# EAGLE design XBee-Regulated-v17 (EAGLE 5.11)
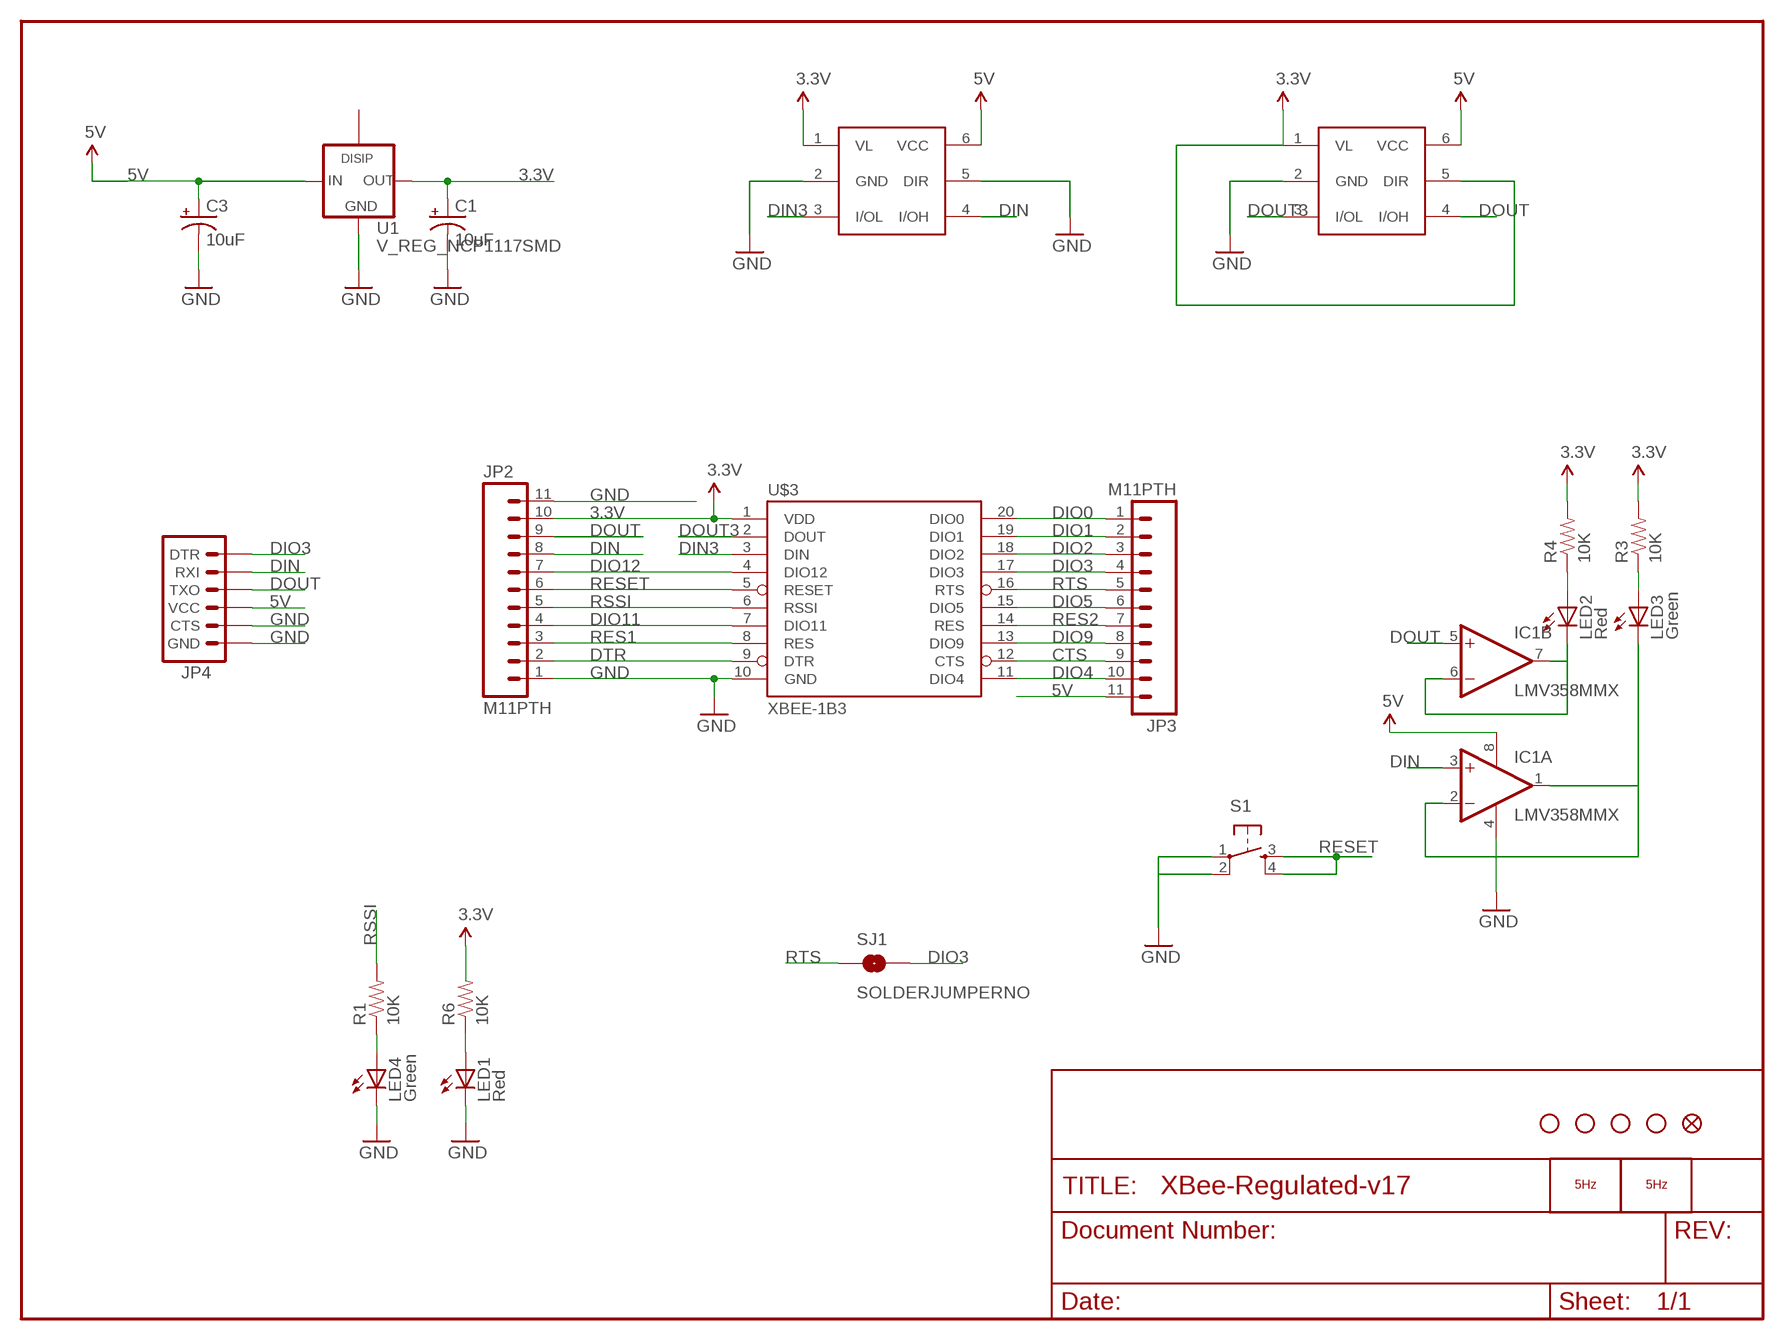
[diagram p0: schematic, sheet 1]

## Parts
C1  10uF  CAP_POL1206  [EIA3216]
C3  10uF  CAP_POL1206  [EIA3216]
IC1  LMV358MMX  [MSOP08]
JP2  M11PTH  [1X11]
JP3  M11PTH  [1X11]
JP4  ARDUINO_SERIAL_PROGRAMPTH  [1X06]
LED1  Red  LED0603  [LED-0603]
LED2  Red  LED0603  [LED-0603]
LED3  Green  LED0603  [LED-0603]
LED4  Green  LED0603  [LED-0603]
LOGO2  LOGO_5HZ_H_COOPER_10MM  [5HZ_LOGO_H_COOPER_10MM]
LOGO3  LOGO_5HZ_MAIN_5MM  [5HZ_LOGO_MAIN_5MM]
R1  10K  RESISTOR0603-RES  [0603-RES]
R3  10K  RESISTOR0603-RES  [0603-RES]
R4  10K  RESISTOR0603-RES  [0603-RES]
R6  10K  RESISTOR0603-RES  [0603-RES]
S1  TAC_SWITCHSMD  [TACTILE_SWITCH_SMD]
SJ1  SOLDERJUMPERNO  [SJ_2S-NO]
U1  V_REG_NCP1117SMD  [SOT223]
U$3  XBEE-1B3  [XBEE-SMD]
U$5  STAND-OFF  [STAND-OFF]
U$7  MAX337  [SOT-363]
U$9  STAND-OFF  [STAND-OFF]
U$10  STAND-OFF  [STAND-OFF]
U$11  STAND-OFF  [STAND-OFF]
U$12  MAX337  [SOT-363]
U$16  FIDUCIAL1X2  [FIDUCIAL-1X2]

## Nets
3.3V [vcc]: C1.A(+) JP2.10 R3.2 R4.2 R6.2 U1.2(OUT) U$3.1(VDD) U$7.1(VL) U$12.1(VL) U$12.5(DIR)
5V [vcc]: C3.A(+) IC1.8(P:V+) JP3.11 JP4.4(VCC) U1.3(IN) U$7.6(VCC) U$12.6(VCC)
CTS: JP3.9 U$3.12(CTS)
DIN: IC1.3(A:+IN) JP2.8 JP4.2(RXI) U$7.4(I/OH)
DIN3: U$3.3(DIN) U$7.3(I/OL)
DIO0: JP3.1 U$3.20(DIO0)
DIO1: JP3.2 U$3.19(DIO1)
DIO2: JP3.3 U$3.18(DIO2)
DIO3: JP3.4 JP4.1(DTR) SJ1.2 U$3.17(DIO3)
DIO4: JP3.10 U$3.11(DIO4)
DIO5: JP3.6 U$3.15(DIO5)
DIO9: JP3.8 U$3.13(DIO9)
DIO11: JP2.4 U$3.7(DIO11)
DIO12: JP2.7 U$3.4(DIO12)
DOUT: IC1.5(B:+IN) JP2.9 JP4.3(TXO) U$12.4(I/OH)
DOUT3: U$3.2(DOUT) U$12.3(I/OL)
DTR: JP2.2 U$3.9(DTR)
GND [vcc]: C1.C(-) C3.C(-) IC1.4(P:V-) JP2.1 JP2.11 JP4.5(CTS) JP4.6(GND) LED1.C LED4.C S1.1 S1.2 U1.1(GND) U$3.10(GND) U$7.2(GND) U$7.5(DIR) U$12.2(GND)
N$1: LED2.A R4.1
N$2: LED4.A R1.1
N$4: LED3.A R3.1
N$6: IC1.6(B:-IN) IC1.7(B:OUT) LED2.C
N$7: IC1.1(A:OUT) IC1.2(A:-IN) LED3.C
N$38: LED1.A R6.1
RES1: JP2.3 U$3.8(RES)
RES2: JP3.7 U$3.14(RES)
RESET: JP2.6 S1.3 S1.4 U$3.5(RESET)
RSSI: JP2.5 R1.2 U$3.6(RSSI)
RTS: JP3.5 SJ1.1 U$3.16(RTS)
Unconnected: U1.4

## Library data of the parts
C1 C3 = SparkFun:CAP_POL: Capacitor Polarized These are standard SMD and PTH capacitors. Normally 10uF, 47uF, and 100uF in electrolytic and tantalum varieties. Always verify the external diameter of the through hole cap, it varies with capacity, voltage, and manufacturer. The EIA devices should be standard.
IC1 = linear:LMV358?*: Dual General Purpose, Low Voltage, Rail-to-Rail Output Operational Amplifiers Source: http://www.national.com/mpf/LM/LMV321.html http://www.national.com/dt/lmv_qual.pdf
JP2 JP3 = SparkFun:M11: Header 11 Standard 11-pin 0.1" header. Use with straight break away headers (SKU : PRT-00116), right angle break away headers (PRT-00553), swiss pins (PRT-00743), machine pins (PRT-00117), and female headers (PRT-00115).
JP4 = SparkFun:ARDUINO_SERIAL_PROGRAM
LED1-LED4 = SparkFun:LED: LEDs Standard schematic elements and footprints for 5mm, 3mm, 1206, and 0603 sized LEDs. 5mm - Spark Fun Electronics SKU : COM-00529 (and others)
LOGO2 LOGO3 = 5hz-electronica:LOGO_5HZ: Logotipo 5Hz "según Pedro"
R1 R3 R4 R6 = SparkFun:RESISTOR: Resistor Basic schematic elements and footprints for 0603, 1206, and PTH resistors.
S1 = SparkFun:TAC_SWITCH: Momentary Switch Button commonly used for reset or general input. Spark Fun Electronics SKU : COM-00097
SJ1 = SparkFun:SOLDERJUMPER: Solder Jumper Standard SMD solder jumper. Used to automate production. Two varients : Normally Open and Normally Closed are the same, but have different paste layers. NC will have a large amount of paste and should jumper during reflow.
U1 = 5hz-electronica:V_REG_NCP1117: Voltage Regulator The NCP1117 series are low dropout positive voltage regulators that are capable of providing an output current that is in excess of 1.0 A with a maximum dropout voltage of 1.2 V at 800 mA over temperature. This series contains eight fixed output voltages of 1.5 V, 1.8 V, 2.0 V, 2.5 V, 2.85 V, 3.3 V, 5.0 V, and 12 V that have no minimum load requirement to maintain regulation. Also included is an adjustable output version that can be programmed from 1.25 V to 18.8 V with two external resistors. On chip trimming adjusts the reference/output voltage to within ±1.0% accuracy. Internal protection features consist of output current limiting, safe operating area compensation, and thermal shutdown. The NCP1117 series can operate with up to 20 V input. Devices are available in SOT-223 and DPAK packages.
U$3 = 5hz-electronica:XBEE-1
U$5 U$9-U$11 = SparkFun:STAND-OFF: Stand Off This is the mechanical footprint for a #4 phillips button head screw. Use the keepout ring to avoid running the screw head into surrounding components. SKU : PRT-00447
U$7 U$12 = MAX337:MAX337
U$16 = SparkFun:FIDUCIAL: Fiducial Alignment Points Various fiducial points for machine vision alignment.

## Net classes
1 vcc: width 0.254 mm
2 gnd: width 0.254 mm

## Board
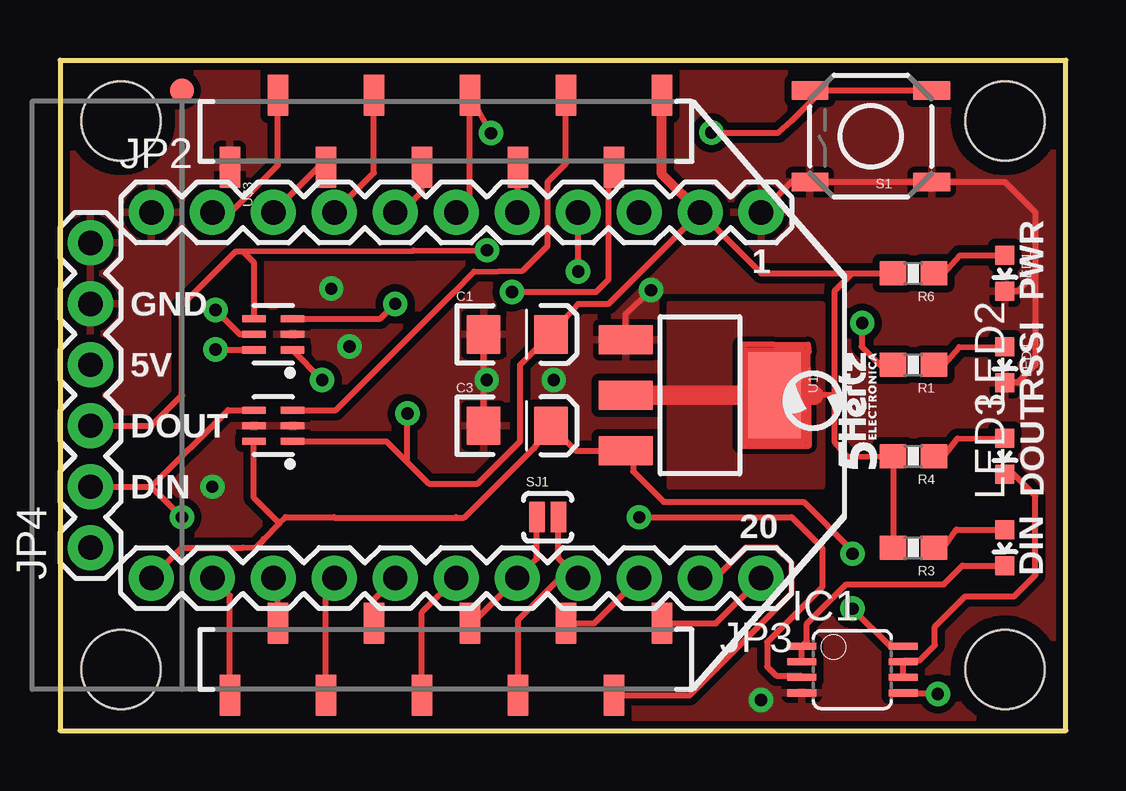
[diagram p1: board, top side]
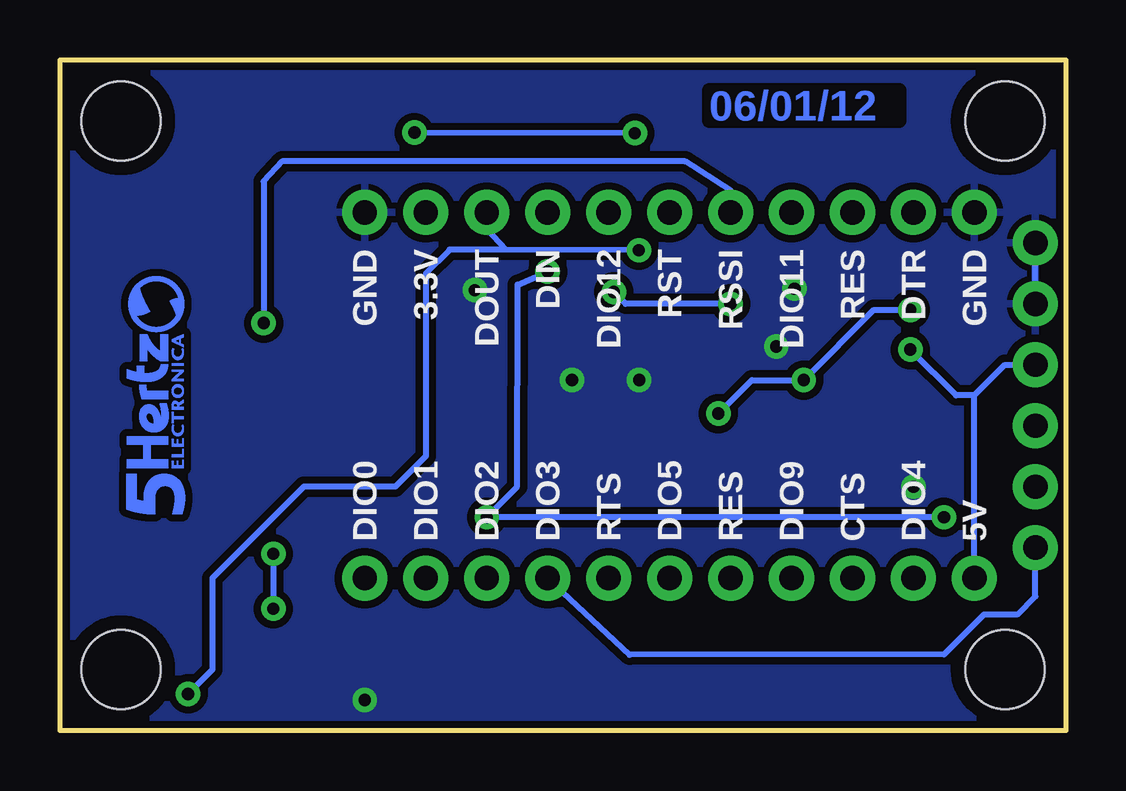
[diagram p2: board, bottom side, seen from below]

Size 41.91 x 27.94 mm. Coordinates in mm from the lower left corner, seen from the top.
Outline: 41.91,0 41.91,27.94 0,27.94 0,0 41.91,0
Copper layers (1*16): Top 0.035mm / dielectric 1.5mm / Bottom 0.035mm
Design rules: minimum track width 8mil, minimum drill 20mil, track to track 8mil, track to pad 8mil, pad to pad 8mil, via to via 8mil, smd to smd 8mil, copper to edge 10mil, drill to drill 8mil, minimum pad ring 12mil, minimum via ring 10mil, stop-mask expansion 4mil, vias tented up to drill 25mil, thermal gap 10mil

### Footprints (pad centres in the part's own frame; a part is rotated, then mirrored left to right if it is on the bottom)
EIA3216 = smd 1.4 x 1.6: A 1.4,0; C -1.4,0
MSOP08 = smd 0.3 x 1.2: 1 -0.976,-2.113; 2 -0.326,-2.113; 3 0.324,-2.113; 4 0.974,-2.113; 5 0.974,2.112; 6 0.324,2.112; 7 -0.326,2.112; 8 -0.976,2.112
1X11 = drill 1.016 pad 1.88: 1 0,0; 2 2.54,0; 3 5.08,0; 4 7.62,0; 5 10.16,0; 6 12.7,0; 7 15.24,0; 8 17.78,0; 9 20.32,0; 10 22.86,0; 11 25.4,0
1X06 = drill 1.016 pad 1.88: 1 0,0; 2 2.54,0; 3 5.08,0; 4 7.62,0; 5 10.16,0; 6 12.7,0
LED-0603 = smd 0.8 x 0.8: A 0,-0.75; C 0,0.75
0603-RES = smd 1.1 x 1: 1 -0.85,0; 2 0.85,0
TACTILE_SWITCH_SMD = smd 1.524 x 0.762: 1 -2.54,1.905; 2 2.54,1.905; 3 -2.54,-1.905; 4 2.54,-1.905
SJ_2S-NO = smd 0.635 x 1.27: 1 -0.45,0; 2 0.45,0
SOT223 = smd 1.219 x 2.235: 1 -2.311,-3.099; 2 0,-3.099; 3 2.311,-3.099 | smd 3.6 x 2.2: 4 0,3.099
XBEE-SMD = smd 1.7 x 0.85: 1 -12.5,20; 2 -9.5,18; 3 -12.5,16; 4 -9.5,14; 5 -12.5,12; 6 -9.5,10; 7 -12.5,8; 8 -9.5,6; 9 -12.5,4; 10 -9.5,2; 11 12.5,2; 12 9.5,4; 13 12.5,6; 14 9.5,8; 15 12.5,10; 16 9.5,12; 17 12.5,14; 18 9.5,16; 19 12.5,18; 20 9.5,20
STAND-OFF = hole 3.302: 0,0
SOT-363 = smd 0.3 x 0.99: 1 -0.65,-0.8; 2 0,-0.8; 3 0.65,-0.8; 4 0.65,0.81; 5 0,0.81; 6 -0.65,0.81
FIDUCIAL-1X2 = smd 1 x 1: 1 0,0

### Placement (x,y rotation side)
C1  19.05,16.51 0 top
C3  19.05,12.7 0 top
IC1  33.02,2.54 270 top
JP2  3.81,21.59 0 top
JP3  29.21,6.35 180 top
JP4  1.27,7.62 90 top
LED1  39.37,19.05 180 top
LED2  39.37,11.43 180 top
LED3  39.37,7.62 180 top
LED4  39.37,15.24 180 top
LOGO2  36.7,9.02 90 bottom
LOGO3  34.04,10.92 90 top
R1  35.56,15.24 180 top
R3  35.56,7.62 180 top
R4  35.56,11.43 180 top
R6  35.56,19.05 180 top
S1  33.78,24.77 180 top
SJ1  20.32,8.89 0 top
U1  26.67,13.97 270 top
U$3  5.08,13.97 270 top
U$5  2.54,2.54 0 top
U$7  8.89,12.7 90 top
U$9  2.54,25.4 0 top
U$10  39.37,25.4 0 top
U$11  39.37,2.54 0 top
U$12  8.89,16.51 90 top
U$16  5.08,26.67 0 top

### Tracks (layer width: path | path; a pad name or v marks a point on that pad's centre or on a via)
3.3V  (via drill 0.51)
  Top 0.254: U1.2 22.99,13.97 | 33.02,19.05 29.21,19.05 JP2.10 22.86,17.78 21.59,17.78 C1.A 19.18,15.24 19.18,12.06 17.4,10.29 15.37,10.29 14.48,11.18 | 33.02,19.05 R6.2 | R3.2 R4.2 32.8,11.4 32.27,12.04 32.27,13.99 | 32.27,13.99 31.41,13.97 | 32.27,13.99 32.27,18.3 33.02,19.05 | U$7.1 13.6,12.05 14.48,11.18 | v10.92,14.61 9.69,15.84 U$12.1 9.68,15.88 | 14.48,11.18 v14.48,13.21 | U$12.5 7.49,16.51 v6.48,17.53
  Top 0.406: U$3.1 25.08,23.18 JP2.10
  Top 0.813: 31.41,13.97 U1.2
  Bottom 0.254: v14.48,13.21 13.08,14.61 v10.92,14.61 8,17.53 v6.48,17.53
  pour Top: 25.4,10.16 25.4,17.78 31.75,17.78 31.75,10.16
5V  (via drill 0.51)
  Top 0.254: JP3.11 5.08,7.62 7.62,7.62 8.18,7.63 8.48,7.95 8.48,7.98 9.14,8.64 | 19.79,11.83 19.71,11.72 | 19.79,11.83 C3.A 21.49,11.66 U1.3 23.88,11.35 23.88,10.79 25.15,9.53 30.99,9.53 33.02,7.49 v33.02,7.37 | 9.14,8.64 9.4,8.89 11.42,8.89 11.43,8.88 16.5,8.88 | 16.5,8.88 16.51,8.89 | 16.5,8.88 16.84,8.88 19.79,11.83 | IC1.8 34.58,3.52 v33.02,5.08 | U$12.6 7,15.86 v6.48,15.88 | U$7.6 8.08,9.7 9.14,8.64
  Bottom 0.254: JP3.11 3.81,13.97 | 3.81,13.97 2.54,15.24 JP4.4 | v33.02,7.37 v33.02,5.08 | 3.81,13.97 4.57,13.97 v6.48,15.88
CTS
  Top 0.254: U$3.12 9.08,6.16 JP3.9
DIN  (via drill 0.51)
  Top 0.254: JP4.2 3.81,10.16 | v24.13,8.89 30.48,8.89 31.75,7.62 31.75,5.97 29.46,3.68 29.46,2.67 29.84,2.29 30.84,2.29 IC1.3 | v21.59,19.13 JP2.8 | 3.81,10.16 v5.08,8.89 | U$7.4 7,13.35 3.81,10.16
  Bottom 0.254: v21.59,19.13 22.85,18.58 22.86,10.16 v24.13,8.89 v5.08,8.89
DIN3
  Top 0.254: U$3.3 21.08,23.62 20.32,22.86 20.32,20.19 19.29,19.16 17.25,19.13 16.42,18.27 11.5,13.35 U$7.3
DIO0
  Top 0.254: U$3.20 27.33,4.47 JP3.1
DIO1
  Top 0.254: U$3.19 26.23,1.47 30.48,5.71 30.48,6.99 29.84,7.62 28.57,7.62 27.3,6.35 JP3.2
DIO2
  Top 0.254: U$3.18 22.25,4.47 JP3.3
DIO3
  Top 0.254: U$3.17 19.08,4.6 20.83,6.35 JP3.4 20.77,7.17 SJ1.2
  Bottom 0.254: JP3.4 18.17,3.15 5.07,3.17 3.42,4.83 2.03,4.83 1.27,5.59 JP4.1
DIO4
  Top 0.254: U$3.11 7.08,5.62 JP3.10
DIO5
  Top 0.254: U$3.15 15.08,4.92 JP3.6
DIO9
  Top 0.254: U$3.13 11.08,6 JP3.8
DIO11
  Top 0.254: U$3.7 13.08,23.24 JP2.4
DIO12
  Top 0.254: U$3.4 19.08,21.62 JP2.7
DOUT  (via drill 0.51)
  Top 0.254: JP4.3 3.81,12.7 5.08,13.97 5.08,17.72 7.33,19.96 7.62,19.97 | 7.62,19.97 14.73,20 v17.79,20.02 | v36.58,1.52 35.17,1.52 IC1.5 | U$12.4 8.08,19.51 7.62,19.97
  Bottom 0.254: v17.79,20.02 23.33,20.04 | 23.33,20.04 24.13,20.88 JP2.9 | 23.33,20.04 25.68,20.04 26.67,19.05 26.67,11.43 27.94,10.16 31.75,10.16 35.56,6.35 35.56,2.54 v36.58,1.52
DOUT3  (via drill 0.51)
  Top 0.254: U$3.2 22.86,22.86 22.86,18.8 22.34,18.27 v18.83,18.27 | U$12.3 13.35,17.16 v13.97,17.78
  Bottom 0.254: v13.97,17.78 18.34,17.78 v18.83,18.27
DTR
  Top 0.254: JP2.2 7.11,21.59 9.08,23.56 U$3.9
GND  (via drill 0.51)
  Top 0.254: C3.C C1.C | JP2.11 30.48,22.86 S1.2 S1.1 39.37,22.86 40.64,21.59 40.64,19.05 | LED1.C 39.64,18.31 39.9,18.31 40.64,19.05 | LED4.C 39.73,14.5 39.9,14.5 40.64,15.24 40.64,19.05 | v24.62,18.35 23.57,17.35 U1.1
  Bottom 0.254: JP4.5 JP4.6
  other vias: 11.3,18.41 17.78,14.61 20.57,14.61 29.21,1.27 6.35,10.16 12.06,16
  pour Bottom (isolate 0.305): 0,27.94 41.91,27.94 41.91,0 0,0
  pour Top (isolate 0.305, rank 6): 0,27.94 41.91,27.94 41.91,0 0,0
N$1
  Top 0.254: R4.1 36.83,11.43 37.39,12.17 LED2.A
N$2
  Top 0.254: R1.1 36.83,15.24 37.47,15.98 LED4.A
N$3
  Top 0.254: 30.95,14.12 30.96,15.85 28.55,15.85 28.56,12.09 30.99,12.09 31,13.92
N$4
  Top 0.254: LED3.A 37.35,8.37 36.83,7.62 R3.1
N$5
  Top 0.254: 31.17,15.81 31.22,11.87 28.36,11.87 28.37,16.12 31.17,16.08 31.19,15.75
N$6
  Top 0.254: LED2.C 39.74,10.68 40.64,9.78 40.64,6.48 39.75,5.59 37.72,5.59 36.45,4.32 36.45,3.56 35.81,2.92 35.19,2.92 IC1.7 IC1.6
N$7
  Top 0.254: LED3.C 37.6,6.87 36.83,6.1 32.77,6.1 31.11,4.45 31.11,3.72 IC1.1 IC1.2
N$38
  Top 0.254: R6.1 36.83,19.05 37.49,19.8 LED1.A
RES1
  Top 0.254: U$3.8 10.77,23.47 JP2.3
RES2
  Top 0.254: U$3.14 13.08,5.46 JP3.7
RESET  (via drill 0.51)
  Top 0.254: JP2.6 17.08,22.16 U$3.5 v17.96,24.89 | 31.75,26.67 S1.4 | 31.75,26.67 S1.3 | 31.75,26.67 30.48,25.4 29.93,24.92 v27.14,24.92
  Bottom 0.254: v17.96,24.89 v27.14,24.92
RSSI  (via drill 0.51)
  Top 0.254: JP2.5 14.22,21.59 15.08,22.45 U$3.6 | R1.2 34.16,15.24 33.4,16 33.4,16.95 v33.43,16.98
  Bottom 0.254: v33.43,16.98 33.43,22.89 32.65,23.71 15.86,23.71 13.98,22.5 JP2.5
RTS
  Top 0.254: U$3.16 17.17,4.47 JP3.5 19.87,7.17 SJ1.1

### Text on the board
Bottom: 06/01/12
tPlace: 1 | PWR | GND | 5V | RSSI | DOUT | DIN | DOUT | 20 | DIN
bPlace: GND | DTR | RES | DIO11 | RSSI | RST | DIO12 | DIN | DOUT | 3.3V | GND | 5V | DIO4 | CTS | DIO9 | RES | DIO5 | RTS | DIO3 | DIO2 | DIO1 | DIO0
tValues: XBee Socket Up | DNP | DNP | XBee Socket Up